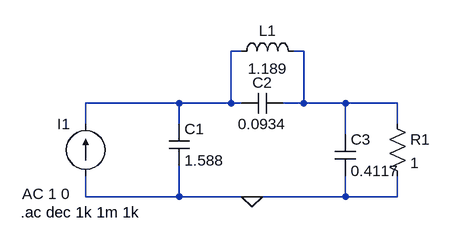
[diagram p0: schematic ej2.asc]
ej2.asc, the LTspice schematic file:
Version 4
SHEET 1 880 680
WIRE 224 16 208 16
WIRE 320 16 304 16
WIRE 128 96 -16 96
WIRE 208 96 208 16
WIRE 208 96 128 96
WIRE 224 96 208 96
WIRE 320 96 320 16
WIRE 320 96 288 96
WIRE 384 96 320 96
WIRE 464 96 384 96
WIRE -16 128 -16 96
WIRE 128 128 128 96
WIRE 464 128 464 96
WIRE 384 144 384 96
WIRE -16 240 -16 208
WIRE 128 240 128 192
WIRE 128 240 -16 240
WIRE 240 240 128 240
WIRE 384 240 384 208
WIRE 384 240 240 240
WIRE 464 240 464 208
WIRE 464 240 384 240
FLAG 240 240 0
SYMBOL cap 112 128 R0
SYMATTR InstName C1
SYMATTR Value 1.588
SYMBOL cap 288 80 R90
WINDOW 0 0 32 VBottom 2
WINDOW 3 32 32 VTop 2
SYMATTR InstName C2
SYMATTR Value 0.0934
SYMBOL ind 208 32 R270
WINDOW 0 32 56 VTop 2
WINDOW 3 5 56 VBottom 2
SYMATTR InstName L1
SYMATTR Value 1.189
SYMBOL cap 368 144 R0
SYMATTR InstName C3
SYMATTR Value 0.4117
SYMBOL res 448 112 R0
SYMATTR InstName R1
SYMATTR Value 1
SYMBOL current -16 208 R180
WINDOW 0 24 80 Left 2
WINDOW 3 24 0 Left 2
WINDOW 123 24 -28 Left 2
WINDOW 39 0 0 Left 0
SYMATTR InstName I1
SYMATTR Value ""
SYMATTR Value2 AC 1 0
TEXT -116 264 Left 2 !.ac dec 1k 1m 1k

The netlist it stands for:
* ej2.asc
C1 N001 0 1.588
C2 N002 N001 0.0934
L1 N001 N002 1.189
C3 N002 0 0.4117
R1 N002 0 1
I1 0 N001 AC 1 0
.ac dec 1k 1m 1k
.backanno
.end